# Altium schematic sheet CONNECTORs.SchDoc
size 299 x 400 mm
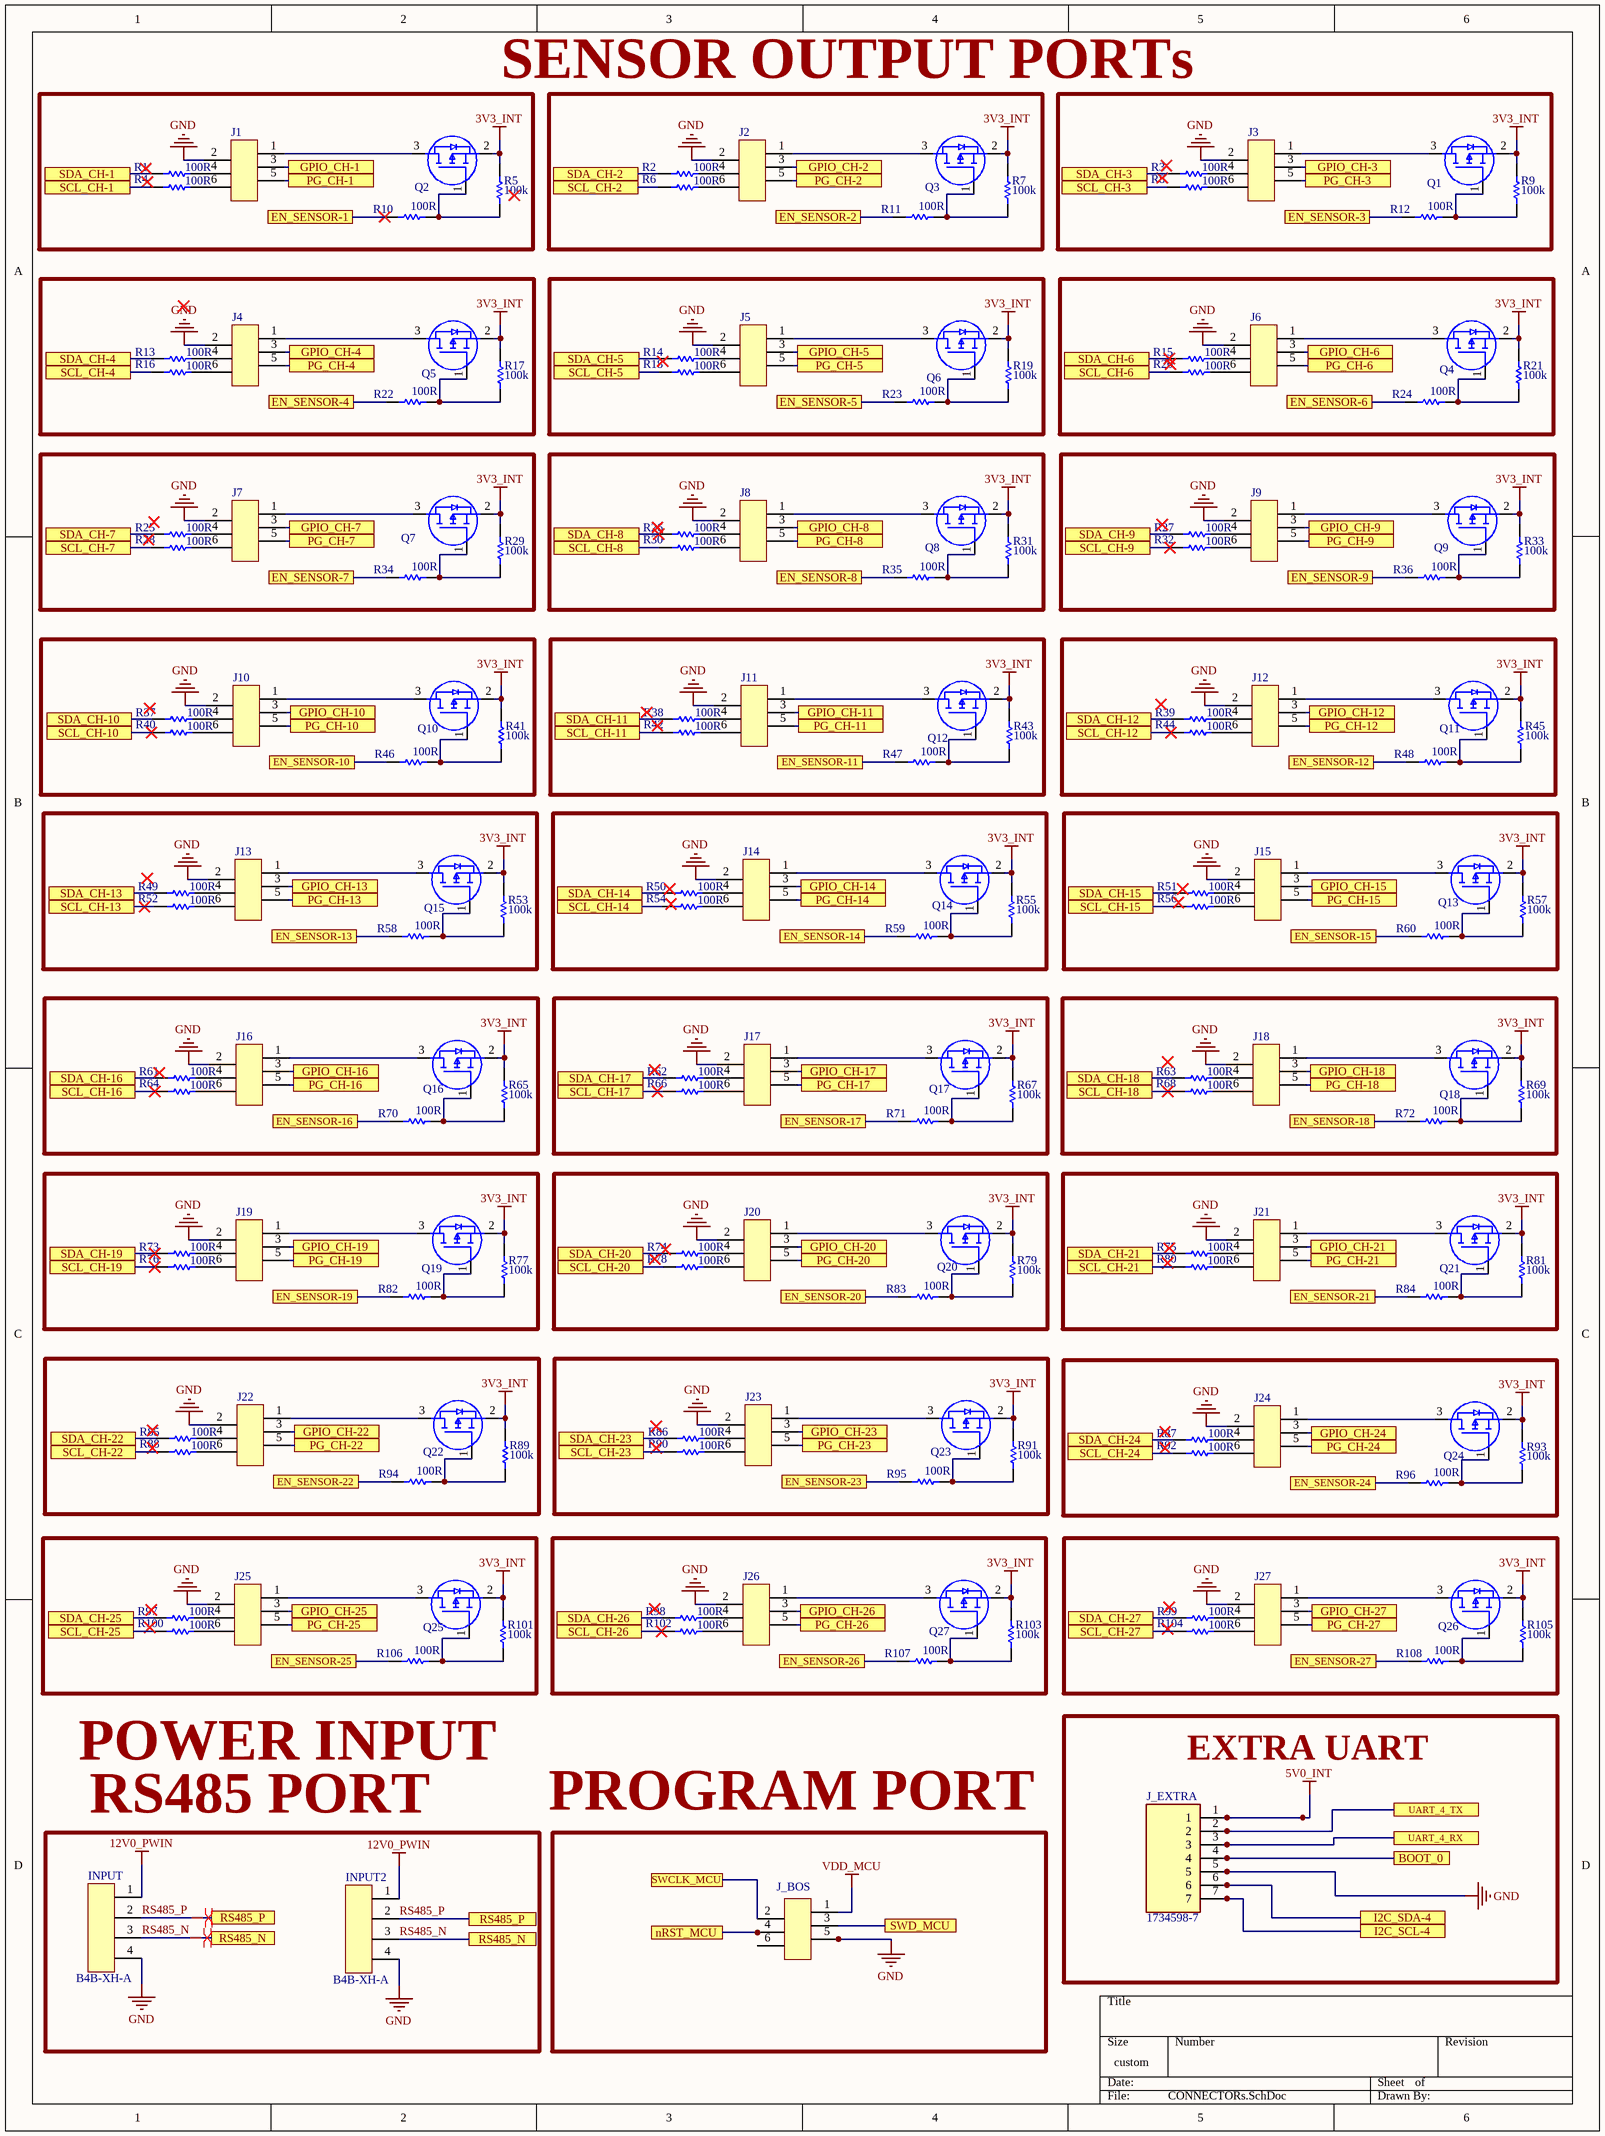
[diagram p0: CONNECTORs.SchDoc]

## Parts
INPUT  B4B-XH-A  [B4B-XH-A]
INPUT2  B4B-XH-A  [B4B-XH-A]
J1  009159006651906  [009159006651906]  (value not drawn)
J2  009159006651906  [009159006651906]  (value not drawn)
J3  009159006651906  [009159006651906]  (value not drawn)
J4  009159006651906  [009159006651906]  (value not drawn)
J5  009159006651906  [009159006651906]  (value not drawn)
J6  009159006651906  [009159006651906]  (value not drawn)
J7  009159006651906  [009159006651906]  (value not drawn)
J8  009159006651906  [009159006651906]  (value not drawn)
J9  009159006651906  [009159006651906]  (value not drawn)
J10  009159006651906  [009159006651906]  (value not drawn)
J11  009159006651906  [009159006651906]  (value not drawn)
J12  009159006651906  [009159006651906]  (value not drawn)
J13  009159006651906  [009159006651906]  (value not drawn)
J14  009159006651906  [009159006651906]  (value not drawn)
J15  009159006651906  [009159006651906]  (value not drawn)
J16  009159006651906  [009159006651906]  (value not drawn)
J17  009159006651906  [009159006651906]  (value not drawn)
J18  009159006651906  [009159006651906]  (value not drawn)
J19  009159006651906  [009159006651906]  (value not drawn)
J20  009159006651906  [009159006651906]  (value not drawn)
J21  009159006651906  [009159006651906]  (value not drawn)
J22  009159006651906  [009159006651906]  (value not drawn)
J23  009159006651906  [009159006651906]  (value not drawn)
J24  009159006651906  [009159006651906]  (value not drawn)
J25  009159006651906  [009159006651906]  (value not drawn)
J26  009159006651906  [009159006651906]  (value not drawn)
J27  009159006651906  [009159006651906]  (value not drawn)
J_BOS  009159006651906  [009159006651906]  (value not drawn)
J_EXTRA  1734598-7  [TE_1734598-7]
Q1  GSF3407  [SOT-23]  (value not drawn)
Q2  GSF3407  [SOT-23]  (value not drawn)
Q3  GSF3407  [SOT-23]  (value not drawn)
Q4  GSF3407  [SOT-23]  (value not drawn)
Q5  GSF3407  [SOT-23]  (value not drawn)
Q6  GSF3407  [SOT-23]  (value not drawn)
Q7  GSF3407  [SOT-23]  (value not drawn)
Q8  GSF3407  [SOT-23]  (value not drawn)
Q9  GSF3407  [SOT-23]  (value not drawn)
Q10  GSF3407  [SOT-23]  (value not drawn)
Q11  GSF3407  [SOT-23]  (value not drawn)
Q12  GSF3407  [SOT-23]  (value not drawn)
Q13  GSF3407  [SOT-23]  (value not drawn)
Q14  GSF3407  [SOT-23]  (value not drawn)
Q15  GSF3407  [SOT-23]  (value not drawn)
Q16  GSF3407  [SOT-23]  (value not drawn)
Q17  GSF3407  [SOT-23]  (value not drawn)
Q18  GSF3407  [SOT-23]  (value not drawn)
Q19  GSF3407  [SOT-23]  (value not drawn)
Q20  GSF3407  [SOT-23]  (value not drawn)
Q21  GSF3407  [SOT-23]  (value not drawn)
Q22  GSF3407  [SOT-23]  (value not drawn)
Q23  GSF3407  [SOT-23]  (value not drawn)
Q24  GSF3407  [SOT-23]  (value not drawn)
Q25  GSF3407  [SOT-23]  (value not drawn)
Q26  GSF3407  [SOT-23]  (value not drawn)
Q27  GSF3407  [SOT-23]  (value not drawn)
R1  value 100R  [RES_0402_SMD]  (hidden comment: RMCF0402JT100R)
R2  value 100R  [RES_0402_SMD]  (hidden comment: RMCF0402JT100R)
R3  value 100R  [RES_0402_SMD]  (hidden comment: RMCF0402JT100R)
R4  value 100R  [RES_0402_SMD]  (hidden comment: RMCF0402JT100R)
R5  value 100k  [RES_0402_SMD]  (hidden comment: RMCF0402JT100K)
R6  value 100R  [RES_0402_SMD]  (hidden comment: RMCF0402JT100R)
R7  value 100k  [RES_0402_SMD]  (hidden comment: RMCF0402JT100K)
R8  value 100R  [RES_0402_SMD]  (hidden comment: RMCF0402JT100R)
R9  value 100k  [RES_0402_SMD]  (hidden comment: RMCF0402JT100K)
R10  value 100R  [RES_0402_SMD]  (hidden comment: RMCF0402JT100R)
R11  value 100R  [RES_0402_SMD]  (hidden comment: RMCF0402JT100R)
R12  value 100R  [RES_0402_SMD]  (hidden comment: RMCF0402JT100R)
R13  value 100R  [RES_0402_SMD]  (hidden comment: RMCF0402JT100R)
R14  value 100R  [RES_0402_SMD]  (hidden comment: RMCF0402JT100R)
R15  value 100R  [RES_0402_SMD]  (hidden comment: RMCF0402JT100R)
R16  value 100R  [RES_0402_SMD]  (hidden comment: RMCF0402JT100R)
R17  value 100k  [RES_0402_SMD]  (hidden comment: RMCF0402JT100K)
R18  value 100R  [RES_0402_SMD]  (hidden comment: RMCF0402JT100R)
R19  value 100k  [RES_0402_SMD]  (hidden comment: RMCF0402JT100K)
R20  value 100R  [RES_0402_SMD]  (hidden comment: RMCF0402JT100R)
R21  value 100k  [RES_0402_SMD]  (hidden comment: RMCF0402JT100K)
R22  value 100R  [RES_0402_SMD]  (hidden comment: RMCF0402JT100R)
R23  value 100R  [RES_0402_SMD]  (hidden comment: RMCF0402JT100R)
R24  value 100R  [RES_0402_SMD]  (hidden comment: RMCF0402JT100R)
R25  value 100R  [RES_0402_SMD]  (hidden comment: RMCF0402JT100R)
R26  value 100R  [RES_0402_SMD]  (hidden comment: RMCF0402JT100R)
R27  value 100R  [RES_0402_SMD]  (hidden comment: RMCF0402JT100R)
R28  value 100R  [RES_0402_SMD]  (hidden comment: RMCF0402JT100R)
R29  value 100k  [RES_0402_SMD]  (hidden comment: RMCF0402JT100K)
R30  value 100R  [RES_0402_SMD]  (hidden comment: RMCF0402JT100R)
R31  value 100k  [RES_0402_SMD]  (hidden comment: RMCF0402JT100K)
R32  value 100R  [RES_0402_SMD]  (hidden comment: RMCF0402JT100R)
R33  value 100k  [RES_0402_SMD]  (hidden comment: RMCF0402JT100K)
R34  value 100R  [RES_0402_SMD]  (hidden comment: RMCF0402JT100R)
R35  value 100R  [RES_0402_SMD]  (hidden comment: RMCF0402JT100R)
R36  value 100R  [RES_0402_SMD]  (hidden comment: RMCF0402JT100R)
R37  value 100R  [RES_0402_SMD]  (hidden comment: RMCF0402JT100R)
R38  value 100R  [RES_0402_SMD]  (hidden comment: RMCF0402JT100R)
R39  value 100R  [RES_0402_SMD]  (hidden comment: RMCF0402JT100R)
R40  value 100R  [RES_0402_SMD]  (hidden comment: RMCF0402JT100R)
R41  value 100k  [RES_0402_SMD]  (hidden comment: RMCF0402JT100K)
R42  value 100R  [RES_0402_SMD]  (hidden comment: RMCF0402JT100R)
R43  value 100k  [RES_0402_SMD]  (hidden comment: RMCF0402JT100K)
R44  value 100R  [RES_0402_SMD]  (hidden comment: RMCF0402JT100R)
R45  value 100k  [RES_0402_SMD]  (hidden comment: RMCF0402JT100K)
R46  value 100R  [RES_0402_SMD]  (hidden comment: RMCF0402JT100R)
R47  value 100R  [RES_0402_SMD]  (hidden comment: RMCF0402JT100R)
R48  value 100R  [RES_0402_SMD]  (hidden comment: RMCF0402JT100R)
R49  value 100R  [RES_0402_SMD]  (hidden comment: RMCF0402JT100R)
R50  value 100R  [RES_0402_SMD]  (hidden comment: RMCF0402JT100R)
R51  value 100R  [RES_0402_SMD]  (hidden comment: RMCF0402JT100R)
R52  value 100R  [RES_0402_SMD]  (hidden comment: RMCF0402JT100R)
R53  value 100k  [RES_0402_SMD]  (hidden comment: RMCF0402JT100K)
R54  value 100R  [RES_0402_SMD]  (hidden comment: RMCF0402JT100R)
R55  value 100k  [RES_0402_SMD]  (hidden comment: RMCF0402JT100K)
R56  value 100R  [RES_0402_SMD]  (hidden comment: RMCF0402JT100R)
R57  value 100k  [RES_0402_SMD]  (hidden comment: RMCF0402JT100K)
R58  value 100R  [RES_0402_SMD]  (hidden comment: RMCF0402JT100R)
R59  value 100R  [RES_0402_SMD]  (hidden comment: RMCF0402JT100R)
R60  value 100R  [RES_0402_SMD]  (hidden comment: RMCF0402JT100R)
R61  value 100R  [RES_0402_SMD]  (hidden comment: RMCF0402JT100R)
R62  value 100R  [RES_0402_SMD]  (hidden comment: RMCF0402JT100R)
R63  value 100R  [RES_0402_SMD]  (hidden comment: RMCF0402JT100R)
R64  value 100R  [RES_0402_SMD]  (hidden comment: RMCF0402JT100R)
R65  value 100k  [RES_0402_SMD]  (hidden comment: RMCF0402JT100K)
R66  value 100R  [RES_0402_SMD]  (hidden comment: RMCF0402JT100R)
R67  value 100k  [RES_0402_SMD]  (hidden comment: RMCF0402JT100K)
R68  value 100R  [RES_0402_SMD]  (hidden comment: RMCF0402JT100R)
R69  value 100k  [RES_0402_SMD]  (hidden comment: RMCF0402JT100K)
R70  value 100R  [RES_0402_SMD]  (hidden comment: RMCF0402JT100R)
R71  value 100R  [RES_0402_SMD]  (hidden comment: RMCF0402JT100R)
R72  value 100R  [RES_0402_SMD]  (hidden comment: RMCF0402JT100R)
R73  value 100R  [RES_0402_SMD]  (hidden comment: RMCF0402JT100R)
R74  value 100R  [RES_0402_SMD]  (hidden comment: RMCF0402JT100R)
R75  value 100R  [RES_0402_SMD]  (hidden comment: RMCF0402JT100R)
R76  value 100R  [RES_0402_SMD]  (hidden comment: RMCF0402JT100R)
R77  value 100k  [RES_0402_SMD]  (hidden comment: RMCF0402JT100K)
R78  value 100R  [RES_0402_SMD]  (hidden comment: RMCF0402JT100R)
R79  value 100k  [RES_0402_SMD]  (hidden comment: RMCF0402JT100K)
R80  value 100R  [RES_0402_SMD]  (hidden comment: RMCF0402JT100R)
R81  value 100k  [RES_0402_SMD]  (hidden comment: RMCF0402JT100K)
R82  value 100R  [RES_0402_SMD]  (hidden comment: RMCF0402JT100R)
R83  value 100R  [RES_0402_SMD]  (hidden comment: RMCF0402JT100R)
R84  value 100R  [RES_0402_SMD]  (hidden comment: RMCF0402JT100R)
R85  value 100R  [RES_0402_SMD]  (hidden comment: RMCF0402JT100R)
R86  value 100R  [RES_0402_SMD]  (hidden comment: RMCF0402JT100R)
R87  value 100R  [RES_0402_SMD]  (hidden comment: RMCF0402JT100R)
R88  value 100R  [RES_0402_SMD]  (hidden comment: RMCF0402JT100R)
R89  value 100k  [RES_0402_SMD]  (hidden comment: RMCF0402JT100K)
R90  value 100R  [RES_0402_SMD]  (hidden comment: RMCF0402JT100R)
R91  value 100k  [RES_0402_SMD]  (hidden comment: RMCF0402JT100K)
R92  value 100R  [RES_0402_SMD]  (hidden comment: RMCF0402JT100R)
R93  value 100k  [RES_0402_SMD]  (hidden comment: RMCF0402JT100K)
R94  value 100R  [RES_0402_SMD]  (hidden comment: RMCF0402JT100R)
R95  value 100R  [RES_0402_SMD]  (hidden comment: RMCF0402JT100R)
R96  value 100R  [RES_0402_SMD]  (hidden comment: RMCF0402JT100R)
R97  value 100R  [RES_0402_SMD]  (hidden comment: RMCF0402JT100R)
R98  value 100R  [RES_0402_SMD]  (hidden comment: RMCF0402JT100R)
R99  value 100R  [RES_0402_SMD]  (hidden comment: RMCF0402JT100R)
R100  value 100R  [RES_0402_SMD]  (hidden comment: RMCF0402JT100R)
R101  value 100k  [RES_0402_SMD]  (hidden comment: RMCF0402JT100K)
R102  value 100R  [RES_0402_SMD]  (hidden comment: RMCF0402JT100R)
R103  value 100k  [RES_0402_SMD]  (hidden comment: RMCF0402JT100K)
R104  value 100R  [RES_0402_SMD]  (hidden comment: RMCF0402JT100R)
R105  value 100k  [RES_0402_SMD]  (hidden comment: RMCF0402JT100K)
R106  value 100R  [RES_0402_SMD]  (hidden comment: RMCF0402JT100R)
R107  value 100R  [RES_0402_SMD]  (hidden comment: RMCF0402JT100R)
R108  value 100R  [RES_0402_SMD]  (hidden comment: RMCF0402JT100R)

## Blocks framed on the sheet
SENSOR OUTPUT PORTs: J1 Q2 R1 R4 R5 R10
EXTRA UART: J_EXTRA
RS485 PORT: INPUT INPUT2

## Ports
BOOT_0, EN_SENSOR-1, EN_SENSOR-2, EN_SENSOR-3, EN_SENSOR-4, EN_SENSOR-5, EN_SENSOR-6, EN_SENSOR-7, EN_SENSOR-8, EN_SENSOR-9, EN_SENSOR-10, EN_SENSOR-11, EN_SENSOR-12, EN_SENSOR-13, EN_SENSOR-14, EN_SENSOR-15, EN_SENSOR-16, EN_SENSOR-17, EN_SENSOR-18, EN_SENSOR-19, EN_SENSOR-20, EN_SENSOR-21, EN_SENSOR-22, EN_SENSOR-23, EN_SENSOR-24, EN_SENSOR-25, EN_SENSOR-26, EN_SENSOR-27, GPIO_CH-1, GPIO_CH-2, GPIO_CH-3, GPIO_CH-4, GPIO_CH-5, GPIO_CH-6, GPIO_CH-7, GPIO_CH-8, GPIO_CH-9, GPIO_CH-10, GPIO_CH-11, GPIO_CH-12, GPIO_CH-13, GPIO_CH-14, GPIO_CH-15, GPIO_CH-16, GPIO_CH-17, GPIO_CH-18, GPIO_CH-19, GPIO_CH-20, GPIO_CH-21, GPIO_CH-22, GPIO_CH-23, GPIO_CH-24, GPIO_CH-25, GPIO_CH-26, GPIO_CH-27, I2C_SCL-4, I2C_SDA-4, nRST_MCU, PG_CH-1, PG_CH-2, PG_CH-3, PG_CH-4, PG_CH-5, PG_CH-6, PG_CH-7, PG_CH-8, PG_CH-9, PG_CH-10, PG_CH-11, PG_CH-12, PG_CH-13, PG_CH-14, PG_CH-15, PG_CH-16, PG_CH-17, PG_CH-18, PG_CH-19, PG_CH-20, PG_CH-21, PG_CH-22, PG_CH-23, PG_CH-24, PG_CH-25, PG_CH-26, PG_CH-27, RS485_N, RS485_P, SCL_CH-1, SCL_CH-2, SCL_CH-3, SCL_CH-4, SCL_CH-5, SCL_CH-6, SCL_CH-7, SCL_CH-8, SCL_CH-9, SCL_CH-10, SCL_CH-11, SCL_CH-12, SCL_CH-13, SCL_CH-14, SCL_CH-15, SCL_CH-16, SCL_CH-17, SCL_CH-18, SCL_CH-19, SCL_CH-20, SCL_CH-21, SCL_CH-22, SCL_CH-23, SCL_CH-24, SCL_CH-25, SCL_CH-26, SCL_CH-27, SDA_CH-1, SDA_CH-2, SDA_CH-3, SDA_CH-4, SDA_CH-5, SDA_CH-6, SDA_CH-7, SDA_CH-8, SDA_CH-9, SDA_CH-10, SDA_CH-11, SDA_CH-12, SDA_CH-13, SDA_CH-14, SDA_CH-15, SDA_CH-16, SDA_CH-17, SDA_CH-18, SDA_CH-19, SDA_CH-20, SDA_CH-21, SDA_CH-22, SDA_CH-23, SDA_CH-24, SDA_CH-25, SDA_CH-26, SDA_CH-27, SWCLK_MCU, SWD_MCU, UART_4_RX, UART_4_TX

## Nets
3V3_INT: Q1.2(S) Q2.2(S) Q3.2(S) Q4.2(S) Q5.2(S) Q6.2(S) Q7.2(S) Q8.2(S) Q9.2(S) Q10.2(S) Q11.2(S) Q12.2(S) Q13.2(S) Q14.2(S) Q15.2(S) Q16.2(S) Q17.2(S) Q18.2(S) Q19.2(S) Q20.2(S) Q21.2(S) Q22.2(S) Q23.2(S) Q24.2(S) Q25.2(S) Q26.2(S) Q27.2(S) R5.2 R7.2 R9.2 R17.2 R19.2 R21.2 R29.2 R31.2 R33.2 R41.2 R43.2 R45.2 R53.2 R55.2 R57.2 R65.2 R67.2 R69.2 R77.2 R79.2 R81.2 R89.2 R91.2 R93.2 R101.2 R103.2 R105.2
5V0_INT: J_EXTRA.1
12V0_PWIN: INPUT.1 INPUT2.1
GND: INPUT.4 INPUT2.4 J1.2 J2.2 J3.2 J4.2 J5.2 J6.2 J7.2 J8.2 J9.2 J10.2 J11.2 J12.2 J13.2 J14.2 J15.2 J16.2 J17.2 J18.2 J19.2 J20.2 J21.2 J22.2 J23.2 J24.2 J25.2 J26.2 J27.2 J_BOS.5 J_EXTRA.5
VDD_MCU: J_BOS.1
BOOT_0: J_EXTRA.4 ; port BOOT_0
EN_SENSOR-1: R10.2 ; port EN_SENSOR-1
EN_SENSOR-2: R11.2 ; port EN_SENSOR-2
EN_SENSOR-3: R12.2 ; port EN_SENSOR-3
EN_SENSOR-4: R22.2 ; port EN_SENSOR-4
EN_SENSOR-5: R23.2 ; port EN_SENSOR-5
EN_SENSOR-6: R24.2 ; port EN_SENSOR-6
EN_SENSOR-7: R34.2 ; port EN_SENSOR-7
EN_SENSOR-8: R35.2 ; port EN_SENSOR-8
EN_SENSOR-9: R36.2 ; port EN_SENSOR-9
EN_SENSOR-10: R46.2 ; port EN_SENSOR-10
EN_SENSOR-11: R47.2 ; port EN_SENSOR-11
EN_SENSOR-12: R48.2 ; port EN_SENSOR-12
EN_SENSOR-13: R58.2 ; port EN_SENSOR-13
EN_SENSOR-14: R59.2 ; port EN_SENSOR-14
EN_SENSOR-15: R60.2 ; port EN_SENSOR-15
EN_SENSOR-16: R70.2 ; port EN_SENSOR-16
EN_SENSOR-17: R71.2 ; port EN_SENSOR-17
EN_SENSOR-18: R72.2 ; port EN_SENSOR-18
EN_SENSOR-19: R82.2 ; port EN_SENSOR-19
EN_SENSOR-20: R83.2 ; port EN_SENSOR-20
EN_SENSOR-21: R84.2 ; port EN_SENSOR-21
EN_SENSOR-22: R94.2 ; port EN_SENSOR-22
EN_SENSOR-23: R95.2 ; port EN_SENSOR-23
EN_SENSOR-24: R96.2 ; port EN_SENSOR-24
EN_SENSOR-25: R106.2 ; port EN_SENSOR-25
EN_SENSOR-26: R107.2 ; port EN_SENSOR-26
EN_SENSOR-27: R108.2 ; port EN_SENSOR-27
GPIO_CH-1: J1.3 ; port GPIO_CH-1
GPIO_CH-2: J2.3 ; port GPIO_CH-2
GPIO_CH-3: J3.3 ; port GPIO_CH-3
GPIO_CH-4: J4.3 ; port GPIO_CH-4
GPIO_CH-5: J5.3 ; port GPIO_CH-5
GPIO_CH-6: J6.3 ; port GPIO_CH-6
GPIO_CH-7: J7.3 ; port GPIO_CH-7
GPIO_CH-8: J8.3 ; port GPIO_CH-8
GPIO_CH-9: J9.3 ; port GPIO_CH-9
GPIO_CH-10: J10.3 ; port GPIO_CH-10
GPIO_CH-11: J11.3 ; port GPIO_CH-11
GPIO_CH-12: J12.3 ; port GPIO_CH-12
GPIO_CH-13: J13.3 ; port GPIO_CH-13
GPIO_CH-14: J14.3 ; port GPIO_CH-14
GPIO_CH-15: J15.3 ; port GPIO_CH-15
GPIO_CH-16: J16.3 ; port GPIO_CH-16
GPIO_CH-17: J17.3 ; port GPIO_CH-17
GPIO_CH-18: J18.3 ; port GPIO_CH-18
GPIO_CH-19: J19.3 ; port GPIO_CH-19
GPIO_CH-20: J20.3 ; port GPIO_CH-20
GPIO_CH-21: J21.3 ; port GPIO_CH-21
GPIO_CH-22: J22.3 ; port GPIO_CH-22
GPIO_CH-23: J23.3 ; port GPIO_CH-23
GPIO_CH-24: J24.3 ; port GPIO_CH-24
GPIO_CH-25: J25.3 ; port GPIO_CH-25
GPIO_CH-26: J26.3 ; port GPIO_CH-26
GPIO_CH-27: J27.3 ; port GPIO_CH-27
I2C_SCL-4: J_EXTRA.7 ; port I2C_SCL-4
I2C_SDA-4: J_EXTRA.6 ; port I2C_SDA-4
nRST_MCU: J_BOS.4 ; port nRST_MCU
PG_CH-1: J1.5 ; port PG_CH-1
PG_CH-2: J2.5 ; port PG_CH-2
PG_CH-3: J3.5 ; port PG_CH-3
PG_CH-4: J4.5 ; port PG_CH-4
PG_CH-5: J5.5 ; port PG_CH-5
PG_CH-6: J6.5 ; port PG_CH-6
PG_CH-7: J7.5 ; port PG_CH-7
PG_CH-8: J8.5 ; port PG_CH-8
PG_CH-9: J9.5 ; port PG_CH-9
PG_CH-10: J10.5 ; port PG_CH-10
PG_CH-11: J11.5 ; port PG_CH-11
PG_CH-12: J12.5 ; port PG_CH-12
PG_CH-13: J13.5 ; port PG_CH-13
PG_CH-14: J14.5 ; port PG_CH-14
PG_CH-15: J15.5 ; port PG_CH-15
PG_CH-16: J16.5 ; port PG_CH-16
PG_CH-17: J17.5 ; port PG_CH-17
PG_CH-18: J18.5 ; port PG_CH-18
PG_CH-19: J19.5 ; port PG_CH-19
PG_CH-20: J20.5 ; port PG_CH-20
PG_CH-21: J21.5 ; port PG_CH-21
PG_CH-22: J22.5 ; port PG_CH-22
PG_CH-23: J23.5 ; port PG_CH-23
PG_CH-24: J24.5 ; port PG_CH-24
PG_CH-25: J25.5 ; port PG_CH-25
PG_CH-26: J26.5 ; port PG_CH-26
PG_CH-27: J27.5 ; port PG_CH-27
RS485_N: INPUT.3 INPUT2.3 ; port RS485_N
RS485_P: INPUT.2 INPUT2.2 ; port RS485_P
SCL_CH-1: R4.2 ; port SCL_CH-1
SCL_CH-2: R6.2 ; port SCL_CH-2
SCL_CH-3: R8.2 ; port SCL_CH-3
SCL_CH-4: R16.2 ; port SCL_CH-4
SCL_CH-5: R18.2 ; port SCL_CH-5
SCL_CH-6: R20.2 ; port SCL_CH-6
SCL_CH-7: R28.2 ; port SCL_CH-7
SCL_CH-8: R30.2 ; port SCL_CH-8
SCL_CH-9: R32.2 ; port SCL_CH-9
SCL_CH-10: R40.2 ; port SCL_CH-10
SCL_CH-11: R42.2 ; port SCL_CH-11
SCL_CH-12: R44.2 ; port SCL_CH-12
SCL_CH-13: R52.2 ; port SCL_CH-13
SCL_CH-14: R54.2 ; port SCL_CH-14
SCL_CH-15: R56.2 ; port SCL_CH-15
SCL_CH-16: R64.2 ; port SCL_CH-16
SCL_CH-17: R66.2 ; port SCL_CH-17
SCL_CH-18: R68.2 ; port SCL_CH-18
SCL_CH-19: R76.2 ; port SCL_CH-19
SCL_CH-20: R78.2 ; port SCL_CH-20
SCL_CH-21: R80.2 ; port SCL_CH-21
SCL_CH-22: R88.2 ; port SCL_CH-22
SCL_CH-23: R90.2 ; port SCL_CH-23
SCL_CH-24: R92.2 ; port SCL_CH-24
SCL_CH-25: R100.2 ; port SCL_CH-25
SCL_CH-26: R102.2 ; port SCL_CH-26
SCL_CH-27: R104.2 ; port SCL_CH-27
SDA_CH-1: R1.2 ; port SDA_CH-1
SDA_CH-2: R2.2 ; port SDA_CH-2
SDA_CH-3: R3.2 ; port SDA_CH-3
SDA_CH-4: R13.2 ; port SDA_CH-4
SDA_CH-5: R14.2 ; port SDA_CH-5
SDA_CH-6: R15.2 ; port SDA_CH-6
SDA_CH-7: R25.2 ; port SDA_CH-7
SDA_CH-8: R26.2 ; port SDA_CH-8
SDA_CH-9: R27.2 ; port SDA_CH-9
SDA_CH-10: R37.2 ; port SDA_CH-10
SDA_CH-11: R38.2 ; port SDA_CH-11
SDA_CH-12: R39.2 ; port SDA_CH-12
SDA_CH-13: R49.2 ; port SDA_CH-13
SDA_CH-14: R50.2 ; port SDA_CH-14
SDA_CH-15: R51.2 ; port SDA_CH-15
SDA_CH-16: R61.2 ; port SDA_CH-16
SDA_CH-17: R62.2 ; port SDA_CH-17
SDA_CH-18: R63.2 ; port SDA_CH-18
SDA_CH-19: R73.2 ; port SDA_CH-19
SDA_CH-20: R74.2 ; port SDA_CH-20
SDA_CH-21: R75.2 ; port SDA_CH-21
SDA_CH-22: R85.2 ; port SDA_CH-22
SDA_CH-23: R86.2 ; port SDA_CH-23
SDA_CH-24: R87.2 ; port SDA_CH-24
SDA_CH-25: R97.2 ; port SDA_CH-25
SDA_CH-26: R98.2 ; port SDA_CH-26
SDA_CH-27: R99.2 ; port SDA_CH-27
SWCLK_MCU: J_BOS.2 ; port SWCLK_MCU
SWD_MCU: J_BOS.3 ; port SWD_MCU
UART_4_RX: J_EXTRA.3 ; port UART_4_RX
UART_4_TX: J_EXTRA.2 ; port UART_4_TX
NetJ1_1: J1.1 Q2.3(D)
NetJ1_4: J1.4 R1.1
NetJ1_6: J1.6 R4.1
NetJ2_1: J2.1 Q3.3(D)
NetJ2_4: J2.4 R2.1
NetJ2_6: J2.6 R6.1
NetJ3_1: J3.1 Q1.3(D)
NetJ3_4: J3.4 R3.1
NetJ3_6: J3.6 R8.1
NetJ4_1: J4.1 Q5.3(D)
NetJ4_4: J4.4 R13.1
NetJ4_6: J4.6 R16.1
NetJ5_1: J5.1 Q6.3(D)
NetJ5_4: J5.4 R14.1
NetJ5_6: J5.6 R18.1
NetJ6_1: J6.1 Q4.3(D)
NetJ6_4: J6.4 R15.1
NetJ6_6: J6.6 R20.1
NetJ7_1: J7.1 Q7.3(D)
NetJ7_4: J7.4 R25.1
NetJ7_6: J7.6 R28.1
NetJ8_1: J8.1 Q8.3(D)
NetJ8_4: J8.4 R26.1
NetJ8_6: J8.6 R30.1
NetJ9_1: J9.1 Q9.3(D)
NetJ9_4: J9.4 R27.1
NetJ9_6: J9.6 R32.1
NetJ10_1: J10.1 Q10.3(D)
NetJ10_4: J10.4 R37.1
NetJ10_6: J10.6 R40.1
NetJ11_1: J11.1 Q12.3(D)
NetJ11_4: J11.4 R38.1
NetJ11_6: J11.6 R42.1
NetJ12_1: J12.1 Q11.3(D)
NetJ12_4: J12.4 R39.1
NetJ12_6: J12.6 R44.1
NetJ13_1: J13.1 Q15.3(D)
NetJ13_4: J13.4 R49.1
NetJ13_6: J13.6 R52.1
NetJ14_1: J14.1 Q14.3(D)
NetJ14_4: J14.4 R50.1
NetJ14_6: J14.6 R54.1
NetJ15_1: J15.1 Q13.3(D)
NetJ15_4: J15.4 R51.1
NetJ15_6: J15.6 R56.1
NetJ16_1: J16.1 Q16.3(D)
NetJ16_4: J16.4 R61.1
NetJ16_6: J16.6 R64.1
NetJ17_1: J17.1 Q17.3(D)
NetJ17_4: J17.4 R62.1
NetJ17_6: J17.6 R66.1
NetJ18_1: J18.1 Q18.3(D)
NetJ18_4: J18.4 R63.1
NetJ18_6: J18.6 R68.1
NetJ19_1: J19.1 Q19.3(D)
NetJ19_4: J19.4 R73.1
NetJ19_6: J19.6 R76.1
NetJ20_1: J20.1 Q20.3(D)
NetJ20_4: J20.4 R74.1
NetJ20_6: J20.6 R78.1
NetJ21_1: J21.1 Q21.3(D)
NetJ21_4: J21.4 R75.1
NetJ21_6: J21.6 R80.1
NetJ22_1: J22.1 Q22.3(D)
NetJ22_4: J22.4 R85.1
NetJ22_6: J22.6 R88.1
NetJ23_1: J23.1 Q23.3(D)
NetJ23_4: J23.4 R86.1
NetJ23_6: J23.6 R90.1
NetJ24_1: J24.1 Q24.3(D)
NetJ24_4: J24.4 R87.1
NetJ24_6: J24.6 R92.1
NetJ25_1: J25.1 Q25.3(D)
NetJ25_4: J25.4 R97.1
NetJ25_6: J25.6 R100.1
NetJ26_1: J26.1 Q27.3(D)
NetJ26_4: J26.4 R98.1
NetJ26_6: J26.6 R102.1
NetJ27_1: J27.1 Q26.3(D)
NetJ27_4: J27.4 R99.1
NetJ27_6: J27.6 R104.1
NetQ1_1: Q1.1(G) R9.1 R12.1
NetQ2_1: Q2.1(G) R5.1 R10.1
NetQ3_1: Q3.1(G) R7.1 R11.1
NetQ4_1: Q4.1(G) R21.1 R24.1
NetQ5_1: Q5.1(G) R17.1 R22.1
NetQ6_1: Q6.1(G) R19.1 R23.1
NetQ7_1: Q7.1(G) R29.1 R34.1
NetQ8_1: Q8.1(G) R31.1 R35.1
NetQ9_1: Q9.1(G) R33.1 R36.1
NetQ10_1: Q10.1(G) R41.1 R46.1
NetQ11_1: Q11.1(G) R45.1 R48.1
NetQ12_1: Q12.1(G) R43.1 R47.1
NetQ13_1: Q13.1(G) R57.1 R60.1
NetQ14_1: Q14.1(G) R55.1 R59.1
NetQ15_1: Q15.1(G) R53.1 R58.1
NetQ16_1: Q16.1(G) R65.1 R70.1
NetQ17_1: Q17.1(G) R67.1 R71.1
NetQ18_1: Q18.1(G) R69.1 R72.1
NetQ19_1: Q19.1(G) R77.1 R82.1
NetQ20_1: Q20.1(G) R79.1 R83.1
NetQ21_1: Q21.1(G) R81.1 R84.1
NetQ22_1: Q22.1(G) R89.1 R94.1
NetQ23_1: Q23.1(G) R91.1 R95.1
NetQ24_1: Q24.1(G) R93.1 R96.1
NetQ25_1: Q25.1(G) R101.1 R106.1
NetQ26_1: Q26.1(G) R105.1 R108.1
NetQ27_1: Q27.1(G) R103.1 R107.1

Not connected (* = marked no-connect by the designer): J_BOS 6

## Layout directives
differential pair: RS485_N, RS485_P

## Notes on the sheet
- (near R106) POWER INPUT
- PROGRAM PORT

## Library data of the parts
INPUT INPUT2 = B4B-XH-A: CONN HEADER VERT 4POS 2.5MM; Manufacturer: JST; Place: POP; Part Number: B4B-XH-A; Value: 4pos; Voltage: N/A; Power: N/A; Tolerance: N/A; Package: B4B-XH-A; Operating Temp.: N/A
J1-J27 J_BOS = 009159006651906: CONN EDGE DUAL FMALE 6POS 0.024; Manufacturer: KYOCERA AVX; Place: POP; Value: N/A; Voltage: N/A; Power: N/A; Tolerance: N/A; Package: Special; Operating Temp.: -40~+85; Part Number: 009159006651906
J_EXTRA = 1734598-7: Connector Header Through Hole 7 position 0.049 (1.25mm); MF: TE Connectivity; Package: None; DigiKey-Purchase-URL: https://snapeda.com/shop?store=DigiKey&id=2374857; Value: *; MP: 1734598-7; Mouser-Purchase-URL: https://snapeda.com/shop?store=Mouser&id=2374857; Digi-Key_Part_Number: A99919-ND; EU_RoHS_Compliance: Compliant; SnapEDA_Link: https://www.snapeda.com/parts/1734598-7/TE%20Connectivity%20AMP%20Connectors/view-part/2374857/?ref=snap
Q1-Q27 = GSF3407: P-Channel 30 V 4.1A (Ta) 1.2W (Ta) Surface Mount SOT-23; Manufacturer: Good-Ark Semiconductor; Voltage: 30 V; Power: 1200 mW; Place: POP; Part Number: GSF3407; Value: N/A; Tolerance: N/A; Package: SOT-23; Operating Temp.: -55°C ~ 150°C
R1-R4 R6 R8 R10-R16 R18 R20 R22-R28 R30 R32 R34-R40 R42 R44 R46-R52 R54 R56 R58-R64 R66 R68 R70-R76 R78 R80 R82-R88 R90 R92 R94-R100 R102 R104 R106-R108 = RES_GEN_SMD: Generic Chip Res 100R; Tolerance: 5 %; Place: POP; Package: *; Part Number: RMCF0402JT100R; Power: *; Voltage: *; Operating Temp.: *
R5 R7 R9 R17 R19 R21 R29 R31 R33 R41 R43 R45 R53 R55 R57 R65 R67 R69 R77 R79 R81 R89 R91 R93 R101 R103 R105 = RES_GEN_SMD: Generic Chip Res 158k; Tolerance: 5%; Place: POP; Package: 0402; Part Number: RMCF0402JT100K; Power: *; Voltage: *; Operating Temp.: *